# EAGLE design tester (EAGLE 9.6.2)

## Sheet 1 of 5: BUS
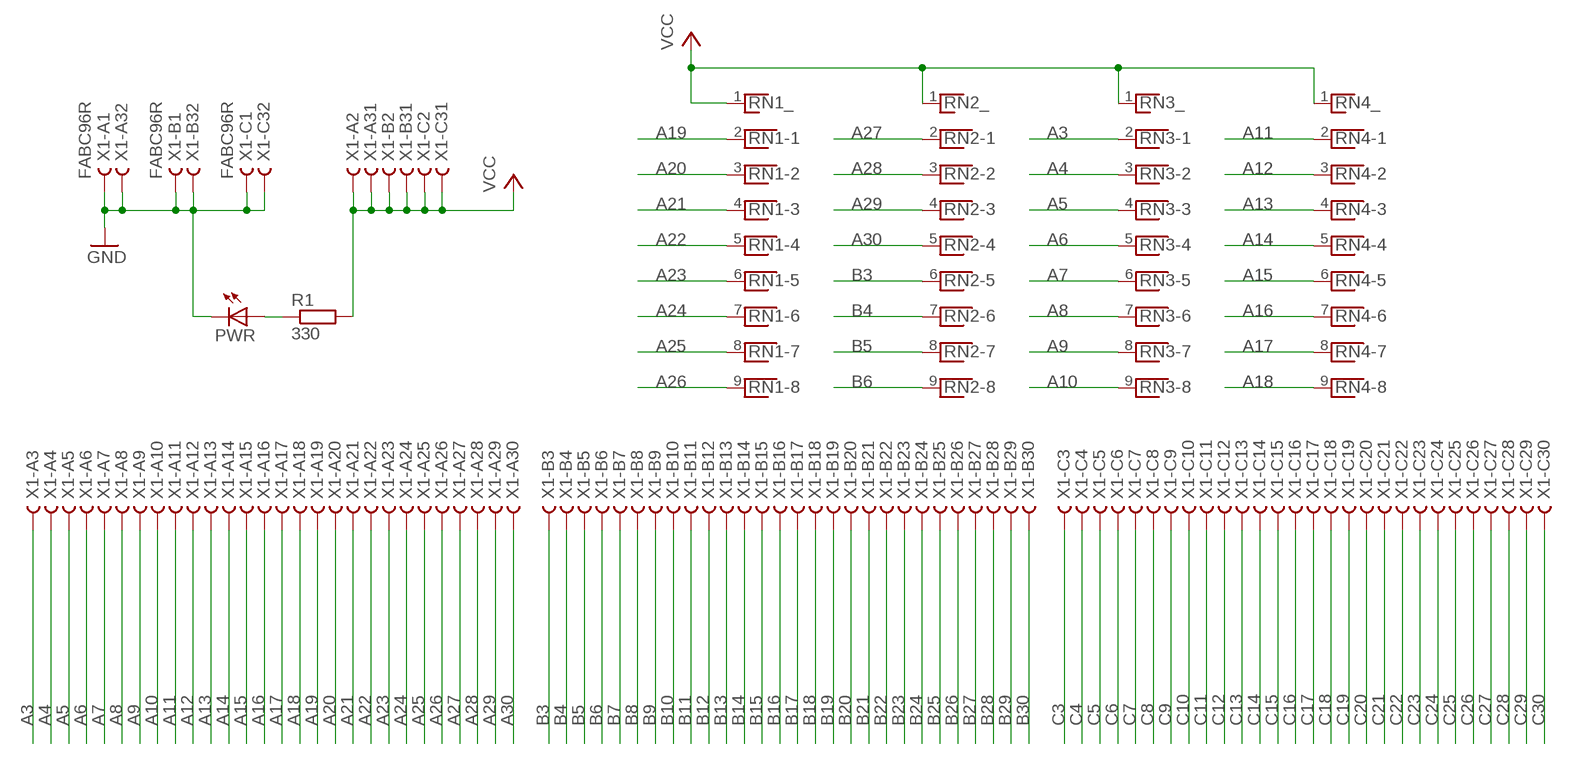
[diagram p0: schematic, sheet 1]

### Parts
PWR  LED5MM  [LED5MM]
R1  330  R0207/10  [0207/10]
RN1  RNX8  [RN-9]
RN2  RNX8  [RN-9]
RN3  RNX8  [RN-9]
RN4  RNX8  [RN-9]
X1  FABC96R  [FABC96R]

### Nets
A3: RN3.2 X1.A3 ; also sheet 5
A4: RN3.3 X1.A4 ; also sheet 5
A5: RN3.4 X1.A5 ; also sheet 5
A6: RN3.5 X1.A6 ; also sheet 5
A7: RN3.6 X1.A7 ; also sheet 5
A8: RN3.7 X1.A8 ; also sheet 5
A9: RN3.8 X1.A9 ; also sheet 5
A10: RN3.9 X1.A10 ; also sheet 5
A11: RN4.2 X1.A11 ; also sheet 5
A12: RN4.3 X1.A12 ; also sheet 5
A13: RN4.4 X1.A13 ; also sheet 5
A14: RN4.5 X1.A14 ; also sheet 5
A15: RN4.6 X1.A15 ; also sheet 5
A16: RN4.7 X1.A16 ; also sheet 5
A17: RN4.8 X1.A17 ; also sheet 5
A18: RN4.9 X1.A18 ; also sheet 5
A19: RN1.2 X1.A19 ; also sheet 5
A20: RN1.3 X1.A20 ; also sheet 5
A21: RN1.4 X1.A21 ; also sheet 5
A22: RN1.5 X1.A22 ; also sheet 5
A23: RN1.6 X1.A23 ; also sheet 5
A24: RN1.7 X1.A24 ; also sheet 5
A25: RN1.8 X1.A25 ; also sheet 5
A26: RN1.9 X1.A26 ; also sheet 5
A27: RN2.2 X1.A27 ; also sheet 5
A28: RN2.3 X1.A28 ; also sheet 5
A29: RN2.4 X1.A29 ; also sheet 5
A30: RN2.5 X1.A30 ; also sheet 5
B3: RN2.6 X1.B3 ; also sheet 5
B4: RN2.7 X1.B4 ; also sheet 5
B5: RN2.8 X1.B5 ; also sheet 5
B6: RN2.9 X1.B6 ; also sheet 5
B7: X1.B7 ; also sheet 5
B8: X1.B8 ; also sheet 5
B9: X1.B9 ; also sheet 5
B10: X1.B10 ; also sheet 5
B11: X1.B11 ; also sheet 5
B12: X1.B12 ; also sheet 5
B13: X1.B13 ; also sheet 5
B14: X1.B14 ; also sheet 5
B15: X1.B15 ; also sheet 5
B16: X1.B16 ; also sheet 5
B17: X1.B17 ; also sheet 5
B18: X1.B18 ; also sheet 5
B19: X1.B19 ; also sheet 5
B20: X1.B20 ; also sheet 5
B21: X1.B21 ; also sheet 5
B22: X1.B22 ; also sheet 5
B23: X1.B23 ; also sheet 5
B24: X1.B24 ; also sheet 5
B25: X1.B25 ; also sheet 5
B26: X1.B26 ; also sheet 5
B27: X1.B27 ; also sheet 5
B28: X1.B28 ; also sheet 5
B29: X1.B29 ; also sheet 5
B30: X1.B30 ; also sheet 5
C3: X1.C3 ; also sheet 5
C4: X1.C4 ; also sheet 5
C5: X1.C5 ; also sheet 5
C6: X1.C6 ; also sheet 5
C7: X1.C7 ; also sheet 5
C8: X1.C8 ; also sheet 5
C9: X1.C9 ; also sheet 5
C10: X1.C10 ; also sheet 5
C11: X1.C11 ; also sheet 5
C12: X1.C12 ; also sheet 5
C13: X1.C13 ; also sheet 5
C14: X1.C14 ; also sheet 5
C15: X1.C15 ; also sheet 5
C16: X1.C16 ; also sheet 5
C17: X1.C17 ; also sheet 5
C18: X1.C18 ; also sheet 5
C19: X1.C19 ; also sheet 5
C20: X1.C20 ; also sheet 5
C21: X1.C21 ; also sheet 5
C22: X1.C22 ; also sheet 5
C23: X1.C23 ; also sheet 5
C24: X1.C24 ; also sheet 5
C25: X1.C25 ; also sheet 5
C26: X1.C26 ; also sheet 5
C27: X1.C27 ; also sheet 5
C28: X1.C28 ; also sheet 5
C29: X1.C29 ; also sheet 5
C30: X1.C30 ; also sheet 5
GND: PWR.K(C) X1.A1 X1.A32 X1.B1 X1.B32 X1.C1 X1.C32 ; also sheet 2,3,4,5
N$5: PWR.A R1.1
VCC: R1.2 RN1.1 RN2.1 RN3.1 RN4.1 X1.A2 X1.A31 X1.B2 X1.B31 X1.C2 X1.C31 ; also sheet 2,3,4

## Sheet 2 of 5: bus cntl
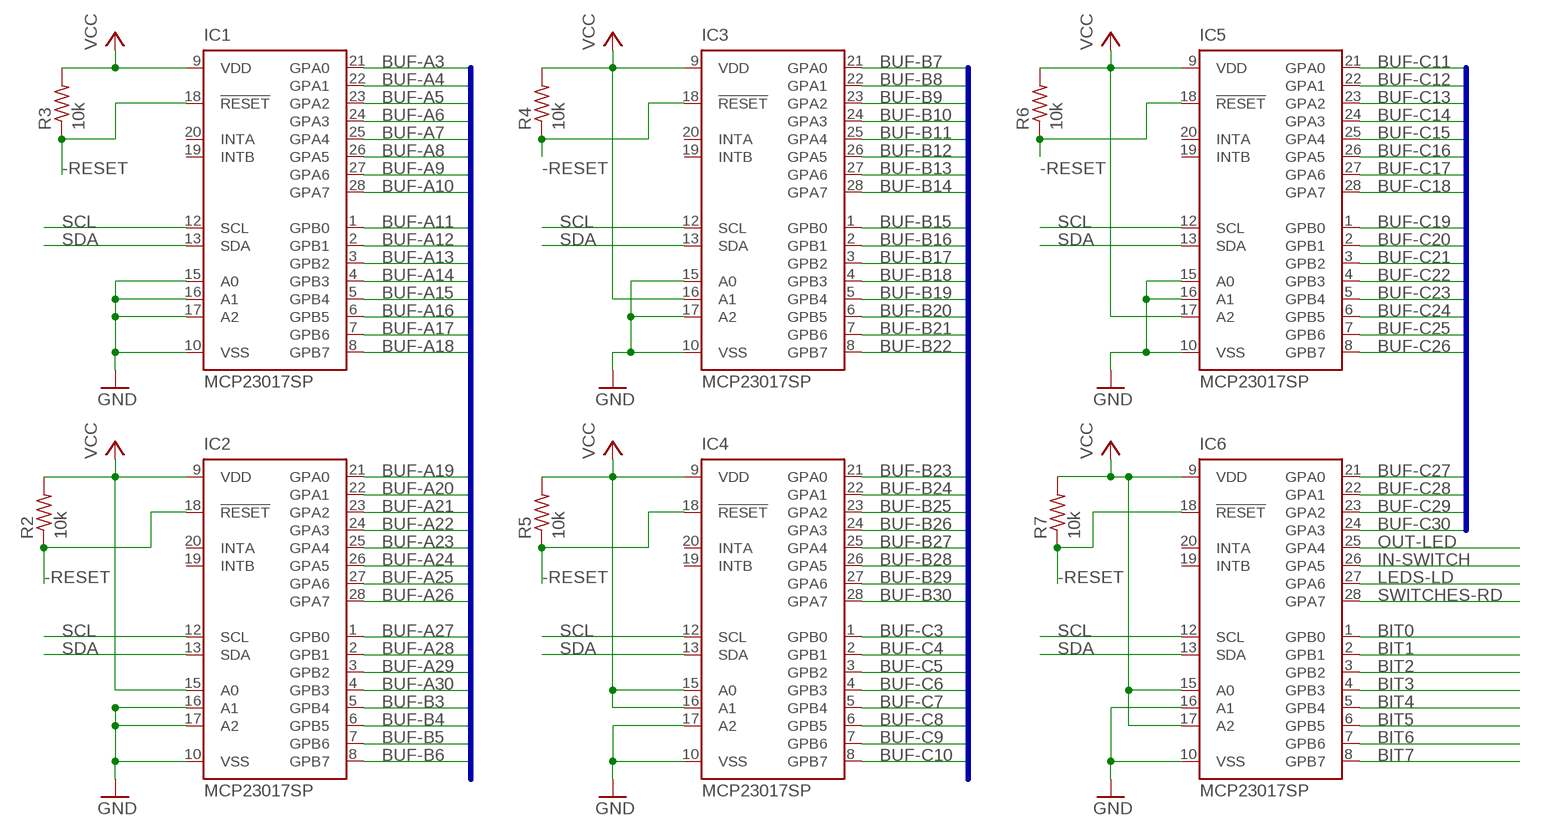
[diagram p1: schematic, sheet 2]

### Parts
IC1  MCP23017SP  [DIL28-3]
IC2  MCP23017SP  [DIL28-3]
IC3  MCP23017SP  [DIL28-3]
IC4  MCP23017SP  [DIL28-3]
IC5  MCP23017SP  [DIL28-3]
IC6  MCP23017SP  [DIL28-3]
R2  10k  R-US_0207/10  [0207/10]
R3  10k  R-US_0207/10  [0207/10]
R4  10k  R-US_0207/10  [0207/10]
R5  10k  R-US_0207/10  [0207/10]
R6  10k  R-US_0207/10  [0207/10]
R7  10k  R-US_0207/10  [0207/10]

### Nets
-RESET: IC1.18(!RESET) IC2.18(!RESET) IC3.18(!RESET) IC4.18(!RESET) IC5.18(!RESET) IC6.18(!RESET) R2.1 R3.1 R4.1 R5.1 R6.1 R7.1 ; also sheet 3
BIT0: IC6.1(GPB0) ; also sheet 4
BIT1: IC6.2(GPB1) ; also sheet 4
BIT2: IC6.3(GPB2) ; also sheet 4
BIT3: IC6.4(GPB3) ; also sheet 4
BIT4: IC6.5(GPB4) ; also sheet 4
BIT5: IC6.6(GPB5) ; also sheet 4
BIT6: IC6.7(GPB6) ; also sheet 4
BIT7: IC6.8(GPB7) ; also sheet 4
BUF-A3: IC1.21(GPA0) ; also sheet 5
BUF-A4: IC1.22(GPA1) ; also sheet 5
BUF-A5: IC1.23(GPA2) ; also sheet 5
BUF-A6: IC1.24(GPA3) ; also sheet 5
BUF-A7: IC1.25(GPA4) ; also sheet 5
BUF-A8: IC1.26(GPA5) ; also sheet 5
BUF-A9: IC1.27(GPA6) ; also sheet 5
BUF-A10: IC1.28(GPA7) ; also sheet 5
BUF-A11: IC1.1(GPB0) ; also sheet 5
BUF-A12: IC1.2(GPB1) ; also sheet 5
BUF-A13: IC1.3(GPB2) ; also sheet 5
BUF-A14: IC1.4(GPB3) ; also sheet 5
BUF-A15: IC1.5(GPB4) ; also sheet 5
BUF-A16: IC1.6(GPB5) ; also sheet 5
BUF-A17: IC1.7(GPB6) ; also sheet 5
BUF-A18: IC1.8(GPB7) ; also sheet 5
BUF-A19: IC2.21(GPA0) ; also sheet 5
BUF-A20: IC2.22(GPA1) ; also sheet 5
BUF-A21: IC2.23(GPA2) ; also sheet 5
BUF-A22: IC2.24(GPA3) ; also sheet 5
BUF-A23: IC2.25(GPA4) ; also sheet 5
BUF-A24: IC2.26(GPA5) ; also sheet 5
BUF-A25: IC2.27(GPA6) ; also sheet 5
BUF-A26: IC2.28(GPA7) ; also sheet 5
BUF-A27: IC2.1(GPB0) ; also sheet 5
BUF-A28: IC2.2(GPB1) ; also sheet 5
BUF-A29: IC2.3(GPB2) ; also sheet 5
BUF-A30: IC2.4(GPB3) ; also sheet 5
BUF-B3: IC2.5(GPB4) ; also sheet 5
BUF-B4: IC2.6(GPB5) ; also sheet 5
BUF-B5: IC2.7(GPB6) ; also sheet 5
BUF-B6: IC2.8(GPB7) ; also sheet 5
BUF-B7: IC3.21(GPA0) ; also sheet 5
BUF-B8: IC3.22(GPA1) ; also sheet 5
BUF-B9: IC3.23(GPA2) ; also sheet 5
BUF-B10: IC3.24(GPA3) ; also sheet 5
BUF-B11: IC3.25(GPA4) ; also sheet 5
BUF-B12: IC3.26(GPA5) ; also sheet 5
BUF-B13: IC3.27(GPA6) ; also sheet 5
BUF-B14: IC3.28(GPA7) ; also sheet 5
BUF-B15: IC3.1(GPB0) ; also sheet 5
BUF-B16: IC3.2(GPB1) ; also sheet 5
BUF-B17: IC3.3(GPB2) ; also sheet 5
BUF-B18: IC3.4(GPB3) ; also sheet 5
BUF-B19: IC3.5(GPB4) ; also sheet 5
BUF-B20: IC3.6(GPB5) ; also sheet 5
BUF-B21: IC3.7(GPB6) ; also sheet 5
BUF-B22: IC3.8(GPB7) ; also sheet 5
BUF-B23: IC4.21(GPA0) ; also sheet 5
BUF-B24: IC4.22(GPA1) ; also sheet 5
BUF-B25: IC4.23(GPA2) ; also sheet 5
BUF-B26: IC4.24(GPA3) ; also sheet 5
BUF-B27: IC4.25(GPA4) ; also sheet 5
BUF-B28: IC4.26(GPA5) ; also sheet 5
BUF-B29: IC4.27(GPA6) ; also sheet 5
BUF-B30: IC4.28(GPA7) ; also sheet 5
BUF-C3: IC4.1(GPB0) ; also sheet 5
BUF-C4: IC4.2(GPB1) ; also sheet 5
BUF-C5: IC4.3(GPB2) ; also sheet 5
BUF-C6: IC4.4(GPB3) ; also sheet 5
BUF-C7: IC4.5(GPB4) ; also sheet 5
BUF-C8: IC4.6(GPB5) ; also sheet 5
BUF-C9: IC4.7(GPB6) ; also sheet 5
BUF-C10: IC4.8(GPB7) ; also sheet 5
BUF-C11: IC5.21(GPA0) ; also sheet 5
BUF-C12: IC5.22(GPA1) ; also sheet 5
BUF-C13: IC5.23(GPA2) ; also sheet 5
BUF-C14: IC5.24(GPA3) ; also sheet 5
BUF-C15: IC5.25(GPA4) ; also sheet 5
BUF-C16: IC5.26(GPA5) ; also sheet 5
BUF-C17: IC5.27(GPA6) ; also sheet 5
BUF-C18: IC5.28(GPA7) ; also sheet 5
BUF-C19: IC5.1(GPB0) ; also sheet 5
BUF-C20: IC5.2(GPB1) ; also sheet 5
BUF-C21: IC5.3(GPB2) ; also sheet 5
BUF-C22: IC5.4(GPB3) ; also sheet 5
BUF-C23: IC5.5(GPB4) ; also sheet 5
BUF-C24: IC5.6(GPB5) ; also sheet 5
BUF-C25: IC5.7(GPB6) ; also sheet 5
BUF-C26: IC5.8(GPB7) ; also sheet 5
BUF-C27: IC6.21(GPA0) ; also sheet 5
BUF-C28: IC6.22(GPA1) ; also sheet 5
BUF-C29: IC6.23(GPA2) ; also sheet 5
BUF-C30: IC6.24(GPA3) ; also sheet 5
GND: IC1.10(VSS) IC1.15(A0) IC1.16(A1) IC1.17(A2) IC2.10(VSS) IC2.16(A1) IC2.17(A2) IC3.10(VSS) IC3.15(A0) IC3.17(A2) IC4.10(VSS) IC4.17(A2) IC5.10(VSS) IC5.15(A0) IC5.16(A1) IC6.10(VSS) IC6.16(A1) ; also sheet 1,3,4,5
IN-SWITCH: IC6.26(GPA5) ; also sheet 4
LEDS-LD: IC6.27(GPA6) ; also sheet 4
OUT-LED: IC6.25(GPA4) ; also sheet 4
SCL: IC1.12(SCL) IC2.12(SCL) IC3.12(SCL) IC4.12(SCL) IC5.12(SCL) IC6.12(SCL) ; also sheet 3
SDA: IC1.13(SDA) IC2.13(SDA) IC3.13(SDA) IC4.13(SDA) IC5.13(SDA) IC6.13(SDA) ; also sheet 3
SWITCHES-RD: IC6.28(GPA7) ; also sheet 4
VCC: IC1.9(VDD) IC2.9(VDD) IC2.15(A0) IC3.9(VDD) IC3.16(A1) IC4.9(VDD) IC4.15(A0) IC4.16(A1) IC5.9(VDD) IC5.17(A2) IC6.9(VDD) IC6.15(A0) IC6.17(A2) R2.2 R3.2 R4.2 R5.2 R6.2 R7.2 ; also sheet 1,3,4
Unconnected: IC1.19(INTB) IC1.20(INTA) IC2.19(INTB) IC2.20(INTA) IC3.19(INTB) IC3.20(INTA) IC4.19(INTB) IC4.20(INTA) IC5.19(INTB) IC5.20(INTA) IC6.19(INTB) IC6.20(INTA)

### Buses
BUF-A3,BUF-A4,BUF-A5,BUF-A6,BUF-A7,BUF-A8,BUF-A9,BUF-A10,BUF-A11,BUF-A12,BUF-A13,BUF-A14,BUF-A15,BUF-A16,BUF-A17,BUF-A18,BUF-A19,BUF-A20,BUF-A21,BUF-A22,BUF-A23,BUF-A24,BUF-A25,BUF-A26,BUF-A27,BUF-A28,BUF-A29,BUF-A30,BUF-B3,BUF-B4,BUF-B5,BUF-B6,BUF-B7,BUF-B8,BUF-B9,BUF-B10,BUF-B11,BUF-B12,BUF-B13,BUF-B14,BUF-B15,BUF-B16,BUF-B17,BUF-B18,BUF-B19,BUF-B20,BUF-B21,BUF-B22,BUF-B23,BUF-B24,BUF-B25,BUF-B26,BUF-B27,BUF-B28,BUF-B29,BUF-B30,BUF-C3,BUF-C4,BUF-C5,BUF-C6,BUF-C7,BUF-C8,BUF-C9,BUF-C10,BUF-C11,BUF-C12,BUF-C13,BUF-C14,BUF-C15,BUF-C16,BUF-C17,BUF-C18,BUF-C19,BUF-C20,BUF-C21,BUF-C22,BUF-C23,BUF-C24,BUF-C25,BUF-C26,BUF-C27,BUF-C28,BUF-C29,BUF-C30

## Sheet 3 of 5: CPU
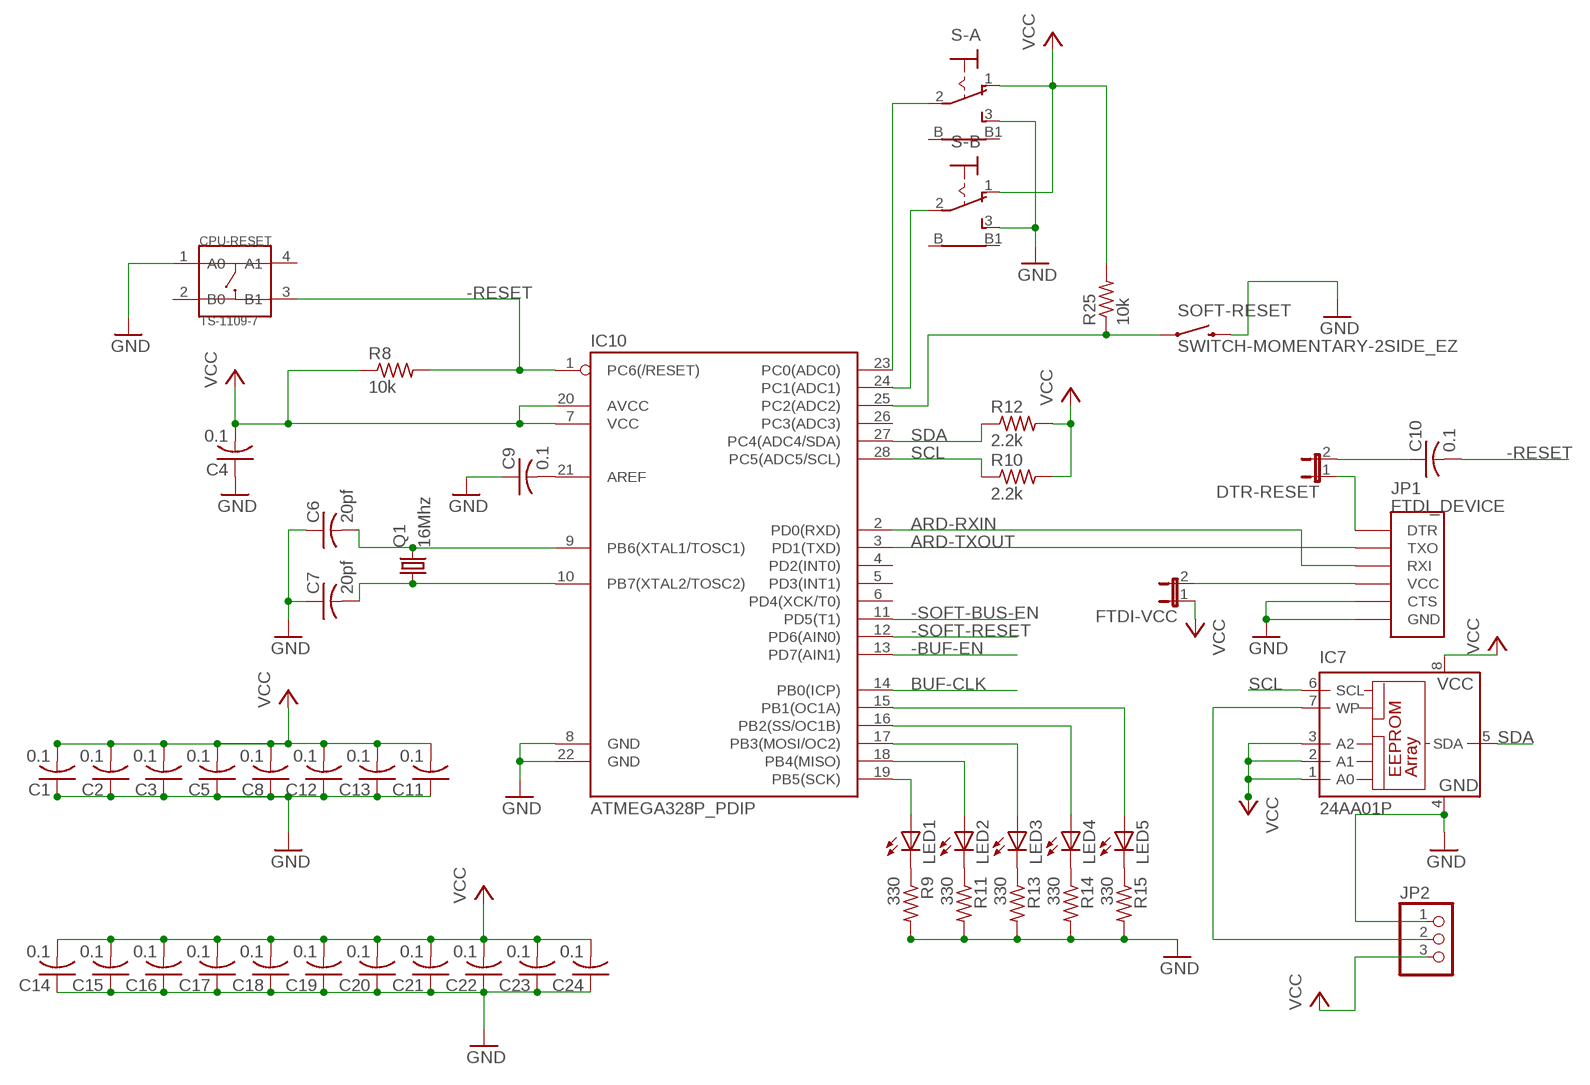
[diagram p2: schematic, sheet 3]

### Parts
C1  0.1  C-US025-024X044  [C025-024X044]
C2  0.1  C-US025-024X044  [C025-024X044]
C3  0.1  C-US025-024X044  [C025-024X044]
C4  0.1  C-US025-024X044  [C025-024X044]
C5  0.1  C-US025-024X044  [C025-024X044]
C6  20pf  C-US025-024X044  [C025-024X044]
C7  20pf  C-US025-024X044  [C025-024X044]
C8  0.1  C-US025-024X044  [C025-024X044]
C9  0.1  C-US025-024X044  [C025-024X044]
C10  0.1  C-US025-024X044  [C025-024X044]
C11  0.1  C-US025-024X044  [C025-024X044]
C12  0.1  C-US025-024X044  [C025-024X044]
C13  0.1  C-US025-024X044  [C025-024X044]
C14  0.1  C-US025-024X044  [C025-024X044]
C15  0.1  C-US025-024X044  [C025-024X044]
C16  0.1  C-US025-024X044  [C025-024X044]
C17  0.1  C-US025-024X044  [C025-024X044]
C18  0.1  C-US025-024X044  [C025-024X044]
C19  0.1  C-US025-024X044  [C025-024X044]
C20  0.1  C-US025-024X044  [C025-024X044]
C21  0.1  C-US025-024X044  [C025-024X044]
C22  0.1  C-US025-024X044  [C025-024X044]
C23  0.1  C-US025-024X044  [C025-024X044]
C24  0.1  C-US025-024X044  [C025-024X044]
CPU-RESET  TS-1109-7  DIP-BUTTON-TOP-BLACK(4P-D6.2MM)  [SW4-6.2X6.2X5.0MM]
DTR-RESET  JP1E  [JP1]
FTDI-VCC  JP1E  [JP1]
IC7  24AA01P  [DIL8]
IC10  ATMEGA328P_PDIP  [DIL28-3]
JP1  FTDI_DEVICE  [FTDI_DEVICE_SIDE]
JP2  PINHD-1X3  [1X03]
LED1  LED5MM  [LED5MM]
LED2  LED5MM  [LED5MM]
LED3  LED5MM  [LED5MM]
LED4  LED5MM  [LED5MM]
LED5  LED5MM  [LED5MM]
Q1  16Mhz  CRYSTALHC49S  [HC49/S]
R8  10k  R-US_0207/10  [0207/10]
R9  330  R-US_0207/10  [0207/10]
R10  2.2k  R-US_0207/10  [0207/10]
R11  330  R-US_0207/10  [0207/10]
R12  2.2k  R-US_0207/10  [0207/10]
R13  330  R-US_0207/10  [0207/10]
R14  330  R-US_0207/10  [0207/10]
R15  330  R-US_0207/10  [0207/10]
R25  10k  R-US_0207/10  [0207/10]
S-A  9070-1W  [9070-1W]
S-B  9070-1W  [9070-1W]
SOFT-RESET  SWITCH-MOMENTARY-2SIDE_EZ  [TACTILE-PTH-SIDEEZ]

### Nets
-BUF-EN: IC10.13(PD7(AIN1)) ; also sheet 5
-RESET: C10.2 CPU-RESET.3(B1) IC10.1(PC6(/RESET)) R8.2 ; also sheet 2
-SOFT-BUS-EN: IC10.11(PD5(T1)) ; also sheet 5
-SOFT-RESET: IC10.12(PD6(AIN0)) ; also sheet 5
ARD-RXIN: IC10.2(PD0(RXD)) JP1.P$3(RXI)
ARD-TXOUT: IC10.3(PD1(TXD)) JP1.P$2(TXO)
BUF-CLK: IC10.14(PB0(ICP)) ; also sheet 5
GND: C1.1 C2.1 C3.1 C4.1 C5.1 C6.1 C7.1 C8.1 C9.1 C11.1 C12.1 C13.1 C14.1 C15.1 C16.1 C17.1 C18.1 C19.1 C20.1 C21.1 C22.1 C23.1 C24.1 CPU-RESET.1(A0) IC7.4(GND) IC10.8(GND) IC10.22(GND) JP1.P$5(CTS) JP1.P$6(GND) JP2.1 R9.2 R11.2 R13.2 R14.2 R15.2 S-A.3(S) S-B.3(S) SOFT-RESET.2 ; also sheet 1,2,4,5
N$1: IC10.19(PB5(SCK)) LED1.A
N$2: IC7.7(WP) JP2.2
N$3: C6.2 IC10.9(PB6(XTAL1/TOSC1)) Q1.2
N$4: C7.2 IC10.10(PB7(XTAL2/TOSC2)) Q1.1
N$6: IC10.18(PB4(MISO)) LED2.A
N$7: IC10.17(PB3(MOSI/OC2)) LED3.A
N$8: IC10.16(PB2(SS/OC1B)) LED4.A
N$9: C10.1 DTR-RESET.2
N$10: IC10.15(PB1(OC1A)) LED5.A
N$11: LED2.K(C) R11.1
N$12: LED1.K(C) R9.1
N$13: LED3.K(C) R13.1
N$14: C9.2 IC10.21(AREF)
N$15: LED4.K(C) R14.1
N$16: LED5.K(C) R15.1
N$18: IC10.23(PC0(ADC0)) S-A.2(P)
N$19: IC10.24(PC1(ADC1)) S-B.2(P)
N$28: DTR-RESET.1 JP1.P$1(DTR)
N$29: FTDI-VCC.2 JP1.P$4(VCC)
N$39: IC10.25(PC2(ADC2)) R25.1 SOFT-RESET.1
SCL: IC7.6(SCL) IC10.28(PC5(ADC5/SCL)) R10.1 ; also sheet 2
SDA: IC7.5(SDA) IC10.27(PC4(ADC4/SDA)) R12.1 ; also sheet 2
VCC: C1.2 C2.2 C3.2 C4.2 C5.2 C8.2 C11.2 C12.2 C13.2 C14.2 C15.2 C16.2 C17.2 C18.2 C19.2 C20.2 C21.2 C22.2 C23.2 C24.2 FTDI-VCC.1 IC7.1(A0) IC7.2(A1) IC7.3(A2) IC7.8(VCC) IC10.7(VCC) IC10.20(AVCC) JP2.3 R8.1 R10.2 R12.2 R25.2 S-A.1(O) S-B.1(O) ; also sheet 1,2,4
Unconnected: CPU-RESET.2(B0) CPU-RESET.4(A1) IC10.4(PD2(INT0)) IC10.5(PD3(INT1)) IC10.6(PD4(XCK/T0)) IC10.26(PC3(ADC3)) S-A.B S-A.B1 S-B.B S-B.B1

## Sheet 4 of 5: I/O
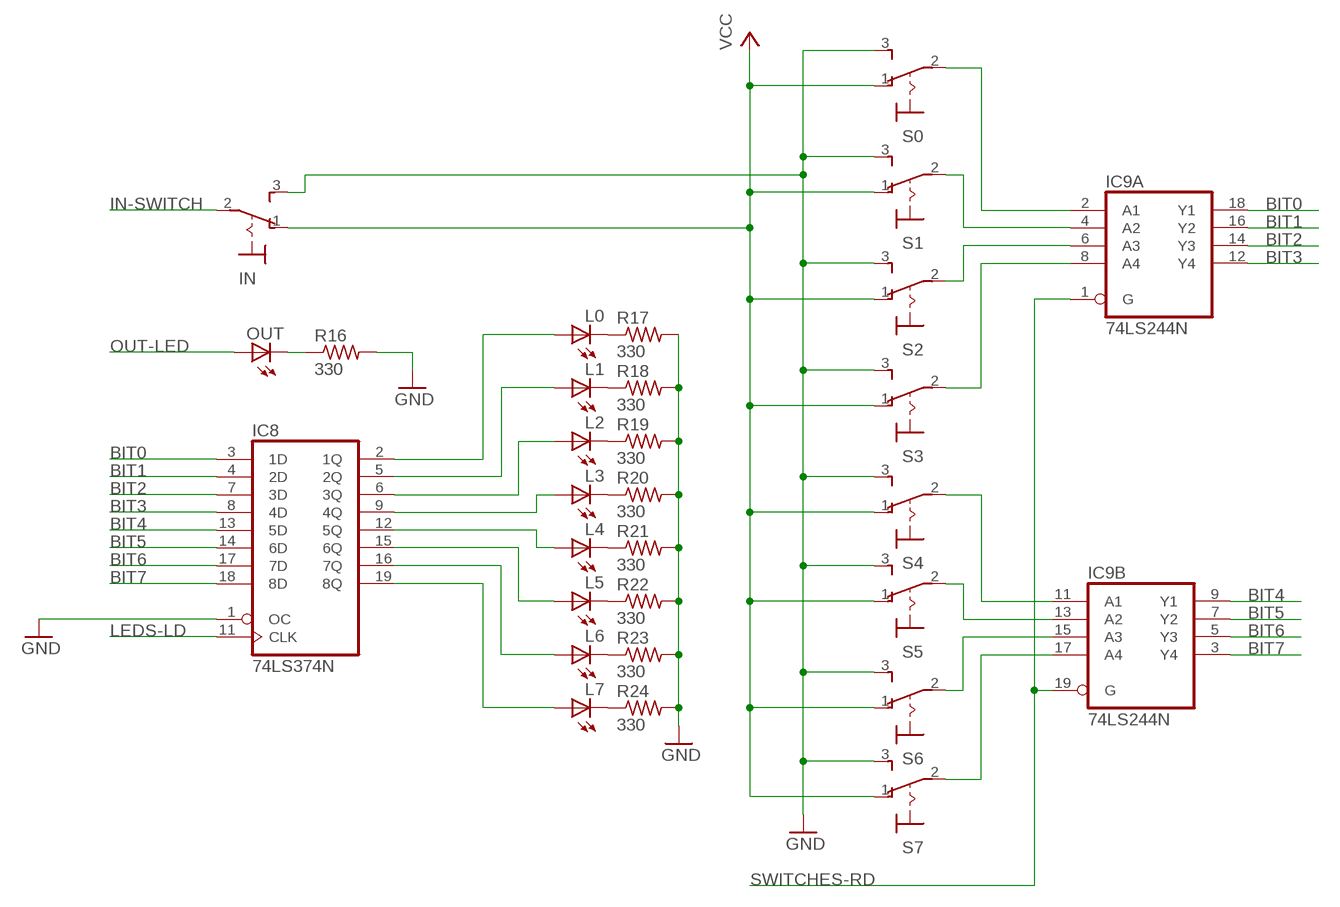
[diagram p3: schematic, sheet 4]

### Parts
IC8  74LS374N  [DIL20]
IC9  74LS244N  [DIL20]
IN  M9040P  [M9040P]
L0  LED5MM  [LED5MM]
L1  LED5MM  [LED5MM]
L2  LED5MM  [LED5MM]
L3  LED5MM  [LED5MM]
L4  LED5MM  [LED5MM]
L5  LED5MM  [LED5MM]
L6  LED5MM  [LED5MM]
L7  LED5MM  [LED5MM]
OUT  LED5MM  [LED5MM]
R16  330  R-US_0207/10  [0207/10]
R17  330  R-US_0207/10  [0207/10]
R18  330  R-US_0207/10  [0207/10]
R19  330  R-US_0207/10  [0207/10]
R20  330  R-US_0207/10  [0207/10]
R21  330  R-US_0207/10  [0207/10]
R22  330  R-US_0207/10  [0207/10]
R23  330  R-US_0207/10  [0207/10]
R24  330  R-US_0207/10  [0207/10]
S0  M9040P  [M9040P]
S1  M9040P  [M9040P]
S2  M9040P  [M9040P]
S3  M9040P  [M9040P]
S4  M9040P  [M9040P]
S5  M9040P  [M9040P]
S6  M9040P  [M9040P]
S7  M9040P  [M9040P]

### Nets
BIT0: IC8.3(1D) IC9.18(A:Y1) ; also sheet 2
BIT1: IC8.4(2D) IC9.16(A:Y2) ; also sheet 2
BIT2: IC8.7(3D) IC9.14(A:Y3) ; also sheet 2
BIT3: IC8.8(4D) IC9.12(A:Y4) ; also sheet 2
BIT4: IC8.13(5D) IC9.9(B:Y1) ; also sheet 2
BIT5: IC8.14(6D) IC9.7(B:Y2) ; also sheet 2
BIT6: IC8.17(7D) IC9.5(B:Y3) ; also sheet 2
BIT7: IC8.18(8D) IC9.3(B:Y4) ; also sheet 2
GND: IC8.1(OC) IN.3(S) R16.2 R17.2 R18.2 R19.2 R20.2 R21.2 R22.2 R23.2 R24.2 S0.3(S) S1.3(S) S2.3(S) S3.3(S) S4.3(S) S5.3(S) S6.3(S) S7.3(S) ; also sheet 1,2,3,5
IN-SWITCH: IN.2(P) ; also sheet 2
LEDS-LD: IC8.11(CLK) ; also sheet 2
N$17: L7.K(C) R24.1
N$20: L6.K(C) R23.1
N$21: L5.K(C) R22.1
N$22: L4.K(C) R21.1
N$23: L3.K(C) R20.1
N$24: L2.K(C) R19.1
N$25: L1.K(C) R18.1
N$26: L0.K(C) R17.1
N$27: OUT.K(C) R16.1
N$31: IC8.5(2Q) L1.A
N$32: IC8.9(4Q) L3.A
N$33: IC8.12(5Q) L4.A
N$34: IC8.15(6Q) L5.A
N$35: IC8.6(3Q) L2.A
N$36: IC8.16(7Q) L6.A
N$37: IC8.19(8Q) L7.A
N$38: IC8.2(1Q) L0.A
N$40: IC9.2(A:A1) S0.2(P)
N$41: IC9.8(A:A4) S3.2(P)
N$42: IC9.6(A:A3) S2.2(P)
N$43: IC9.4(A:A2) S1.2(P)
N$44: IC9.11(B:A1) S4.2(P)
N$45: IC9.17(B:A4) S7.2(P)
N$46: IC9.13(B:A2) S5.2(P)
N$47: IC9.15(B:A3) S6.2(P)
OUT-LED: OUT.A ; also sheet 2
SWITCHES-RD: IC9.1(A:G) IC9.19(B:G) ; also sheet 2
VCC: IN.1(O) S0.1(O) S1.1(O) S2.1(O) S3.1(O) S4.1(O) S5.1(O) S6.1(O) S7.1(O) ; also sheet 1,2,3

## Sheet 5 of 5: Bus Latches
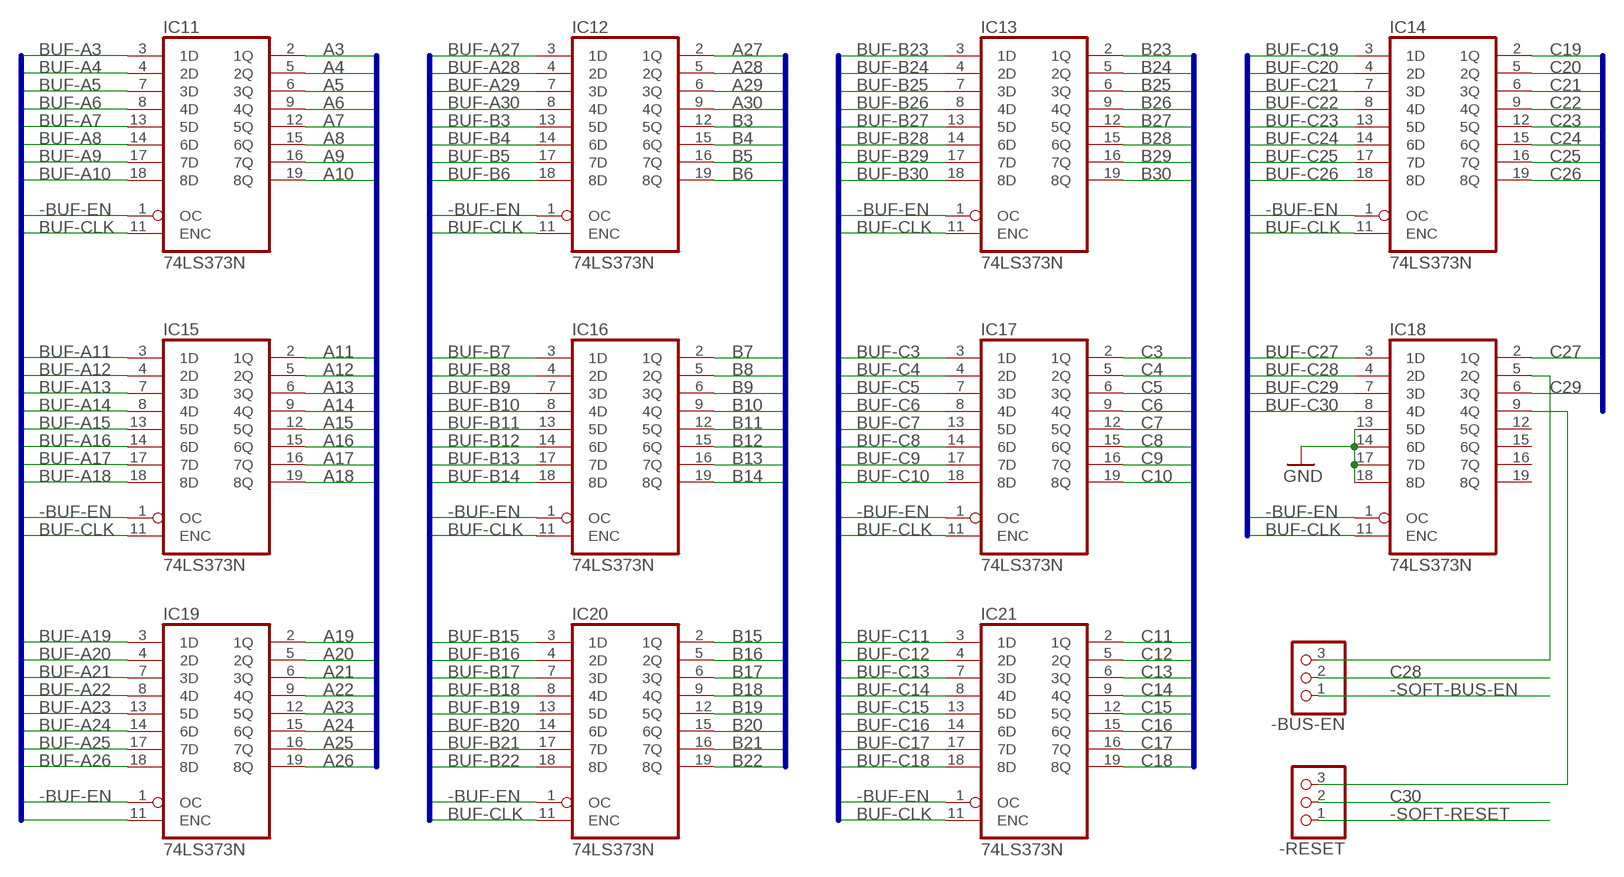
[diagram p4: schematic, sheet 5]

### Parts
-BUS-EN  PINHD-1X3  [1X03]
-RESET  PINHD-1X3  [1X03]
IC11  74LS373N  [DIL20]
IC12  74LS373N  [DIL20]
IC13  74LS373N  [DIL20]
IC14  74LS373N  [DIL20]
IC15  74LS373N  [DIL20]
IC16  74LS373N  [DIL20]
IC17  74LS373N  [DIL20]
IC18  74LS373N  [DIL20]
IC19  74LS373N  [DIL20]
IC20  74LS373N  [DIL20]
IC21  74LS373N  [DIL20]

### Nets
-BUF-EN: IC11.1(OC) IC12.1(OC) IC13.1(OC) IC14.1(OC) IC15.1(OC) IC16.1(OC) IC17.1(OC) IC18.1(OC) IC19.1(OC) IC20.1(OC) IC21.1(OC) ; also sheet 3
-SOFT-BUS-EN: -BUS-EN.1 ; also sheet 3
-SOFT-RESET: -RESET.1 ; also sheet 3
A3: IC11.2(1Q) ; also sheet 1
A4: IC11.5(2Q) ; also sheet 1
A5: IC11.6(3Q) ; also sheet 1
A6: IC11.9(4Q) ; also sheet 1
A7: IC11.12(5Q) ; also sheet 1
A8: IC11.15(6Q) ; also sheet 1
A9: IC11.16(7Q) ; also sheet 1
A10: IC11.19(8Q) ; also sheet 1
A11: IC15.2(1Q) ; also sheet 1
A12: IC15.5(2Q) ; also sheet 1
A13: IC15.6(3Q) ; also sheet 1
A14: IC15.9(4Q) ; also sheet 1
A15: IC15.12(5Q) ; also sheet 1
A16: IC15.15(6Q) ; also sheet 1
A17: IC15.16(7Q) ; also sheet 1
A18: IC15.19(8Q) ; also sheet 1
A19: IC19.2(1Q) ; also sheet 1
A20: IC19.5(2Q) ; also sheet 1
A21: IC19.6(3Q) ; also sheet 1
A22: IC19.9(4Q) ; also sheet 1
A23: IC19.12(5Q) ; also sheet 1
A24: IC19.15(6Q) ; also sheet 1
A25: IC19.16(7Q) ; also sheet 1
A26: IC19.19(8Q) ; also sheet 1
A27: IC12.2(1Q) ; also sheet 1
A28: IC12.5(2Q) ; also sheet 1
A29: IC12.6(3Q) ; also sheet 1
A30: IC12.9(4Q) ; also sheet 1
B3: IC12.12(5Q) ; also sheet 1
B4: IC12.15(6Q) ; also sheet 1
B5: IC12.16(7Q) ; also sheet 1
B6: IC12.19(8Q) ; also sheet 1
B7: IC16.2(1Q) ; also sheet 1
B8: IC16.5(2Q) ; also sheet 1
B9: IC16.6(3Q) ; also sheet 1
B10: IC16.9(4Q) ; also sheet 1
B11: IC16.12(5Q) ; also sheet 1
B12: IC16.15(6Q) ; also sheet 1
B13: IC16.16(7Q) ; also sheet 1
B14: IC16.19(8Q) ; also sheet 1
B15: IC20.2(1Q) ; also sheet 1
B16: IC20.5(2Q) ; also sheet 1
B17: IC20.6(3Q) ; also sheet 1
B18: IC20.9(4Q) ; also sheet 1
B19: IC20.12(5Q) ; also sheet 1
B20: IC20.15(6Q) ; also sheet 1
B21: IC20.16(7Q) ; also sheet 1
B22: IC20.19(8Q) ; also sheet 1
B23: IC13.2(1Q) ; also sheet 1
B24: IC13.5(2Q) ; also sheet 1
B25: IC13.6(3Q) ; also sheet 1
B26: IC13.9(4Q) ; also sheet 1
B27: IC13.12(5Q) ; also sheet 1
B28: IC13.15(6Q) ; also sheet 1
B29: IC13.16(7Q) ; also sheet 1
B30: IC13.19(8Q) ; also sheet 1
BUF-A3: IC11.3(1D) ; also sheet 2
BUF-A4: IC11.4(2D) ; also sheet 2
BUF-A5: IC11.7(3D) ; also sheet 2
BUF-A6: IC11.8(4D) ; also sheet 2
BUF-A7: IC11.13(5D) ; also sheet 2
BUF-A8: IC11.14(6D) ; also sheet 2
BUF-A9: IC11.17(7D) ; also sheet 2
BUF-A10: IC11.18(8D) ; also sheet 2
BUF-A11: IC15.3(1D) ; also sheet 2
BUF-A12: IC15.4(2D) ; also sheet 2
BUF-A13: IC15.7(3D) ; also sheet 2
BUF-A14: IC15.8(4D) ; also sheet 2
BUF-A15: IC15.13(5D) ; also sheet 2
BUF-A16: IC15.14(6D) ; also sheet 2
BUF-A17: IC15.17(7D) ; also sheet 2
BUF-A18: IC15.18(8D) ; also sheet 2
BUF-A19: IC19.3(1D) ; also sheet 2
BUF-A20: IC19.4(2D) ; also sheet 2
BUF-A21: IC19.7(3D) ; also sheet 2
BUF-A22: IC19.8(4D) ; also sheet 2
BUF-A23: IC19.13(5D) ; also sheet 2
BUF-A24: IC19.14(6D) ; also sheet 2
BUF-A25: IC19.17(7D) ; also sheet 2
BUF-A26: IC19.18(8D) ; also sheet 2
BUF-A27: IC12.3(1D) ; also sheet 2
BUF-A28: IC12.4(2D) ; also sheet 2
BUF-A29: IC12.7(3D) ; also sheet 2
BUF-A30: IC12.8(4D) ; also sheet 2
BUF-B3: IC12.13(5D) ; also sheet 2
BUF-B4: IC12.14(6D) ; also sheet 2
BUF-B5: IC12.17(7D) ; also sheet 2
BUF-B6: IC12.18(8D) ; also sheet 2
BUF-B7: IC16.3(1D) ; also sheet 2
BUF-B8: IC16.4(2D) ; also sheet 2
BUF-B9: IC16.7(3D) ; also sheet 2
BUF-B10: IC16.8(4D) ; also sheet 2
BUF-B11: IC16.13(5D) ; also sheet 2
BUF-B12: IC16.14(6D) ; also sheet 2
BUF-B13: IC16.17(7D) ; also sheet 2
BUF-B14: IC16.18(8D) ; also sheet 2
BUF-B15: IC20.3(1D) ; also sheet 2
BUF-B16: IC20.4(2D) ; also sheet 2
BUF-B17: IC20.7(3D) ; also sheet 2
BUF-B18: IC20.8(4D) ; also sheet 2
BUF-B19: IC20.13(5D) ; also sheet 2
BUF-B20: IC20.14(6D) ; also sheet 2
BUF-B21: IC20.17(7D) ; also sheet 2
BUF-B22: IC20.18(8D) ; also sheet 2
BUF-B23: IC13.3(1D) ; also sheet 2
BUF-B24: IC13.4(2D) ; also sheet 2
BUF-B25: IC13.7(3D) ; also sheet 2
BUF-B26: IC13.8(4D) ; also sheet 2
BUF-B27: IC13.13(5D) ; also sheet 2
BUF-B28: IC13.14(6D) ; also sheet 2
BUF-B29: IC13.17(7D) ; also sheet 2
BUF-B30: IC13.18(8D) ; also sheet 2
BUF-C3: IC17.3(1D) ; also sheet 2
BUF-C4: IC17.4(2D) ; also sheet 2
BUF-C5: IC17.7(3D) ; also sheet 2
BUF-C6: IC17.8(4D) ; also sheet 2
BUF-C7: IC17.13(5D) ; also sheet 2
BUF-C8: IC17.14(6D) ; also sheet 2
BUF-C9: IC17.17(7D) ; also sheet 2
BUF-C10: IC17.18(8D) ; also sheet 2
BUF-C11: IC21.3(1D) ; also sheet 2
BUF-C12: IC21.4(2D) ; also sheet 2
BUF-C13: IC21.7(3D) ; also sheet 2
BUF-C14: IC21.8(4D) ; also sheet 2
BUF-C15: IC21.13(5D) ; also sheet 2
BUF-C16: IC21.14(6D) ; also sheet 2
BUF-C17: IC21.17(7D) ; also sheet 2
BUF-C18: IC21.18(8D) ; also sheet 2
BUF-C19: IC14.3(1D) ; also sheet 2
BUF-C20: IC14.4(2D) ; also sheet 2
BUF-C21: IC14.7(3D) ; also sheet 2
BUF-C22: IC14.8(4D) ; also sheet 2
BUF-C23: IC14.13(5D) ; also sheet 2
BUF-C24: IC14.14(6D) ; also sheet 2
BUF-C25: IC14.17(7D) ; also sheet 2
BUF-C26: IC14.18(8D) ; also sheet 2
BUF-C27: IC18.3(1D) ; also sheet 2
BUF-C28: IC18.4(2D) ; also sheet 2
BUF-C29: IC18.7(3D) ; also sheet 2
BUF-C30: IC18.8(4D) ; also sheet 2
BUF-CLK: IC11.11(ENC) IC12.11(ENC) IC13.11(ENC) IC14.11(ENC) IC15.11(ENC) IC16.11(ENC) IC17.11(ENC) IC18.11(ENC) IC19.11(ENC) IC20.11(ENC) IC21.11(ENC) ; also sheet 3
C3: IC17.2(1Q) ; also sheet 1
C4: IC17.5(2Q) ; also sheet 1
C5: IC17.6(3Q) ; also sheet 1
C6: IC17.9(4Q) ; also sheet 1
C7: IC17.12(5Q) ; also sheet 1
C8: IC17.15(6Q) ; also sheet 1
C9: IC17.16(7Q) ; also sheet 1
C10: IC17.19(8Q) ; also sheet 1
C11: IC21.2(1Q) ; also sheet 1
C12: IC21.5(2Q) ; also sheet 1
C13: IC21.6(3Q) ; also sheet 1
C14: IC21.9(4Q) ; also sheet 1
C15: IC21.12(5Q) ; also sheet 1
C16: IC21.15(6Q) ; also sheet 1
C17: IC21.16(7Q) ; also sheet 1
C18: IC21.19(8Q) ; also sheet 1
C19: IC14.2(1Q) ; also sheet 1
C20: IC14.5(2Q) ; also sheet 1
C21: IC14.6(3Q) ; also sheet 1
C22: IC14.9(4Q) ; also sheet 1
C23: IC14.12(5Q) ; also sheet 1
C24: IC14.15(6Q) ; also sheet 1
C25: IC14.16(7Q) ; also sheet 1
C26: IC14.19(8Q) ; also sheet 1
C27: IC18.2(1Q) ; also sheet 1
C28: -BUS-EN.2 ; also sheet 1
C29: IC18.6(3Q) ; also sheet 1
C30: -RESET.2 ; also sheet 1
GND: IC18.13(5D) IC18.14(6D) IC18.17(7D) IC18.18(8D) ; also sheet 1,2,3,4
N$30: -BUS-EN.3 IC18.5(2Q)
N$48: -RESET.3 IC18.9(4Q)
Unconnected: IC18.12(5Q) IC18.15(6Q) IC18.16(7Q) IC18.19(8Q)

### Buses
BUS:A[3..30],B[3..30],C[3..30]
BUF-BUS:BUF-A[3..30],BUF-B[3..30],BUF-C[3..30],BUF-CLK,-BUF-EN

## Power pins joined to a net without a drawn wire
GND: IC8.10(GND) IC9.10(P:GND) IC11.10(GND) IC12.10(GND) IC13.10(GND) IC14.10(GND) IC15.10(GND) IC16.10(GND) IC17.10(GND) IC18.10(GND) IC19.10(GND) IC20.10(GND) IC21.10(GND)
VCC: IC8.20(VCC) IC9.20(P:VCC) IC11.20(VCC) IC12.20(VCC) IC13.20(VCC) IC14.20(VCC) IC15.20(VCC) IC16.20(VCC) IC17.20(VCC) IC18.20(VCC) IC19.20(VCC) IC20.20(VCC) IC21.20(VCC)

## Library data of the parts
-BUS-EN -RESET JP2 = pinhead:PINHD-1X3: PIN HEADER
C1-C24 = adafruit:C-US: CAPACITOR, American symbol
CPU-RESET = Seeed-OPL-Switch:DIP-BUTTON-TOP-BLACK(4P-D6.2MM): 311020032; MPN: TS-1109-7
DTR-RESET FTDI-VCC = jumper:JP1E: JUMPER
IC1-IC6 = microchip:MCP23017: http://ww1.microchip.com/downloads/en/DeviceDoc/21952a.pdf Source: http://ww1.microchip.com/downloads/en/DeviceDoc/21952a.pdf; MF: MICROCHIP; MPN: MCP23017-E/SP; OC_FARNELL: 1332088; OC_NEWARK: 31K2959
IC7 = microchip:24*: Serial EEPROM I2C; MPN: 24AA01-I/P; OC_FARNELL: 1331266; OC_NEWARK: 35M0692
IC8 = 74xx-us:74*374: Octal D type transparent LATCH, edge triggered
IC9 = 74xx-us:74*244: Octal BUFFER and LINE DRIVER, 3-state
IC10 = SparkFun-DigitalIC:ATMEGA328P_PDIP: uC used in the Arduino 32kb flash, 1k EEPROM, 2k SRAM This is the through-hole version of this chip.
IC11-IC21 = 74xx-us:74*373: Octal D type transparent LATCH, edge triggered
IN S0 S1-S7 = switch:M9040P: TOGGLE SWITCH Marquardt
JP1 = SparkFun-Connectors:FTDI_DEVICE: Connector which mates to FTDI basic or FTDI cable.
L0 L1-L7 LED1-LED5 OUT PWR = led:LED: LED OSRAM: - CHIPLED LG R971, LG N971, LY N971, LG Q971, LY Q971, LO R971, LY R971 LH N974, LH R974 LS Q976, LO Q976, LY Q976 LO Q996 - Hyper CHIPLED LW Q18S LB Q993, LB Q99A, LB R99A - SideLED LS A670, LO A670, LY A670, LG A670, LP A670 LB A673, LV A673, LT A673, LW A673 LH A674 LY A675 LS A676, LA A676, LO A676, LY A676, LW A676 LS A679, LY A679, LG A679 - Hyper Micro SIDELED® LS Y876, LA Y876, LO Y876, LY Y876 LT Y87S - SmartLED LW L88C, LW L88S LB L89C, LB L89S, LG L890 LS L89K, LO L89K, LY L89K LS L896, LA L896, LO L896, LY L896 - TOPLED LS T670, LO T670, LY T670, LG T670, LP T670 LSG T670, LSP T670, LSY T670, LOP T670, LYG T670 LG T671, LOG T671, LSG T671 LB T673, LV T673, LT T673, LW T673 LH T674 LS T676, LA T676, LO T676, LY T676, LB T676, LH T676, LSB T676, LW T676 LB T67C, LV T67C, LT T67C, LS T67K, LO T67K, LY T67K, LW E67C LS E67B, LA E67B, LO E67B, LY E67B, LB E67C, LV E67C, LT E67C LW T67C LS T679, LY T679, LG T679 LS T770, LO T770, LY T770, LG T770, LP T770 LB T773, LV T773, LT T773, LW T773 LH T774 LS E675, LA E675, LY E675, LS T675 LS T776, LA T776, LO T776, LY T776, LB T776 LHGB T686 LT T68C, LB T68C - Hyper Mini TOPLED® LB M676 - Mini TOPLED Santana® LG M470 LS M47K, LO M47K, LY M47K Source: http://www.osram.convergy.de LUXEON: - LUMILED® LXK2-PW12-R00, LXK2-PW12-S00, LXK2-PW14-U00, LXK2-PW14-V00 LXK2-PM12-R00, LXK2-PM12-S00, LXK2-PM14-U00 LXK2-PE12-Q00, LXK2-PE12-R00, LXK2-PE12-S00, LXK2-PE14-T00, LXK2-PE14-U00 LXK2-PB12-K00, LXK2-PB12-L00, LXK2-PB12-M00, LXK2-PB14-N00, LXK2-PB14-P00, LXK2-PB14-Q00 LXK2-PR12-L00, LXK2-PR12-M00, LXK2-PR14-Q00, LXK2-PR14-R00 LXK2-PD12-Q00, LXK2-PD12-R00, LXK2-PD12-S00 LXK2-PH12-R00, LXK2-PH12-S00 LXK2-PL12-P00, LXK2-PL12-Q00, LXK2-PL12-R00 Source: www.luxeon.com KINGBRIGHT: KA-3528ASYC Source: www.kingbright.com
Q1 = crystal:CRYSTAL: CRYSTAL; OC_FARNELL: 1667008; OC_NEWARK: unknown
R1 = eagle-ltspice:R: RESISTOR, European symbol; SPICEMODEL: NONE; SPICEPREFIX: R
R2-R7 = adafruit:R-US_: RESISTOR, American symbol
R8-R25 = resistor:R-US_: RESISTOR, American symbol
RN1-RN4 = resistor-net:RNX8: RESISTOR NETWORK; OC_FARNELL: unknown; OC_NEWARK: unknown
S-A S-B = switch:9070-1W: TOGGLE SWITCH Marquardt
SOFT-RESET = SparkFun-Electromechanical:SWITCH-MOMENTARY-2: Various NO switches- pushbuttons, reed, etc
X1 = con-vg:FABC96R: CONNECTOR female, 96 pins, type R, rows ABC, grid 2.54 mm

## Board
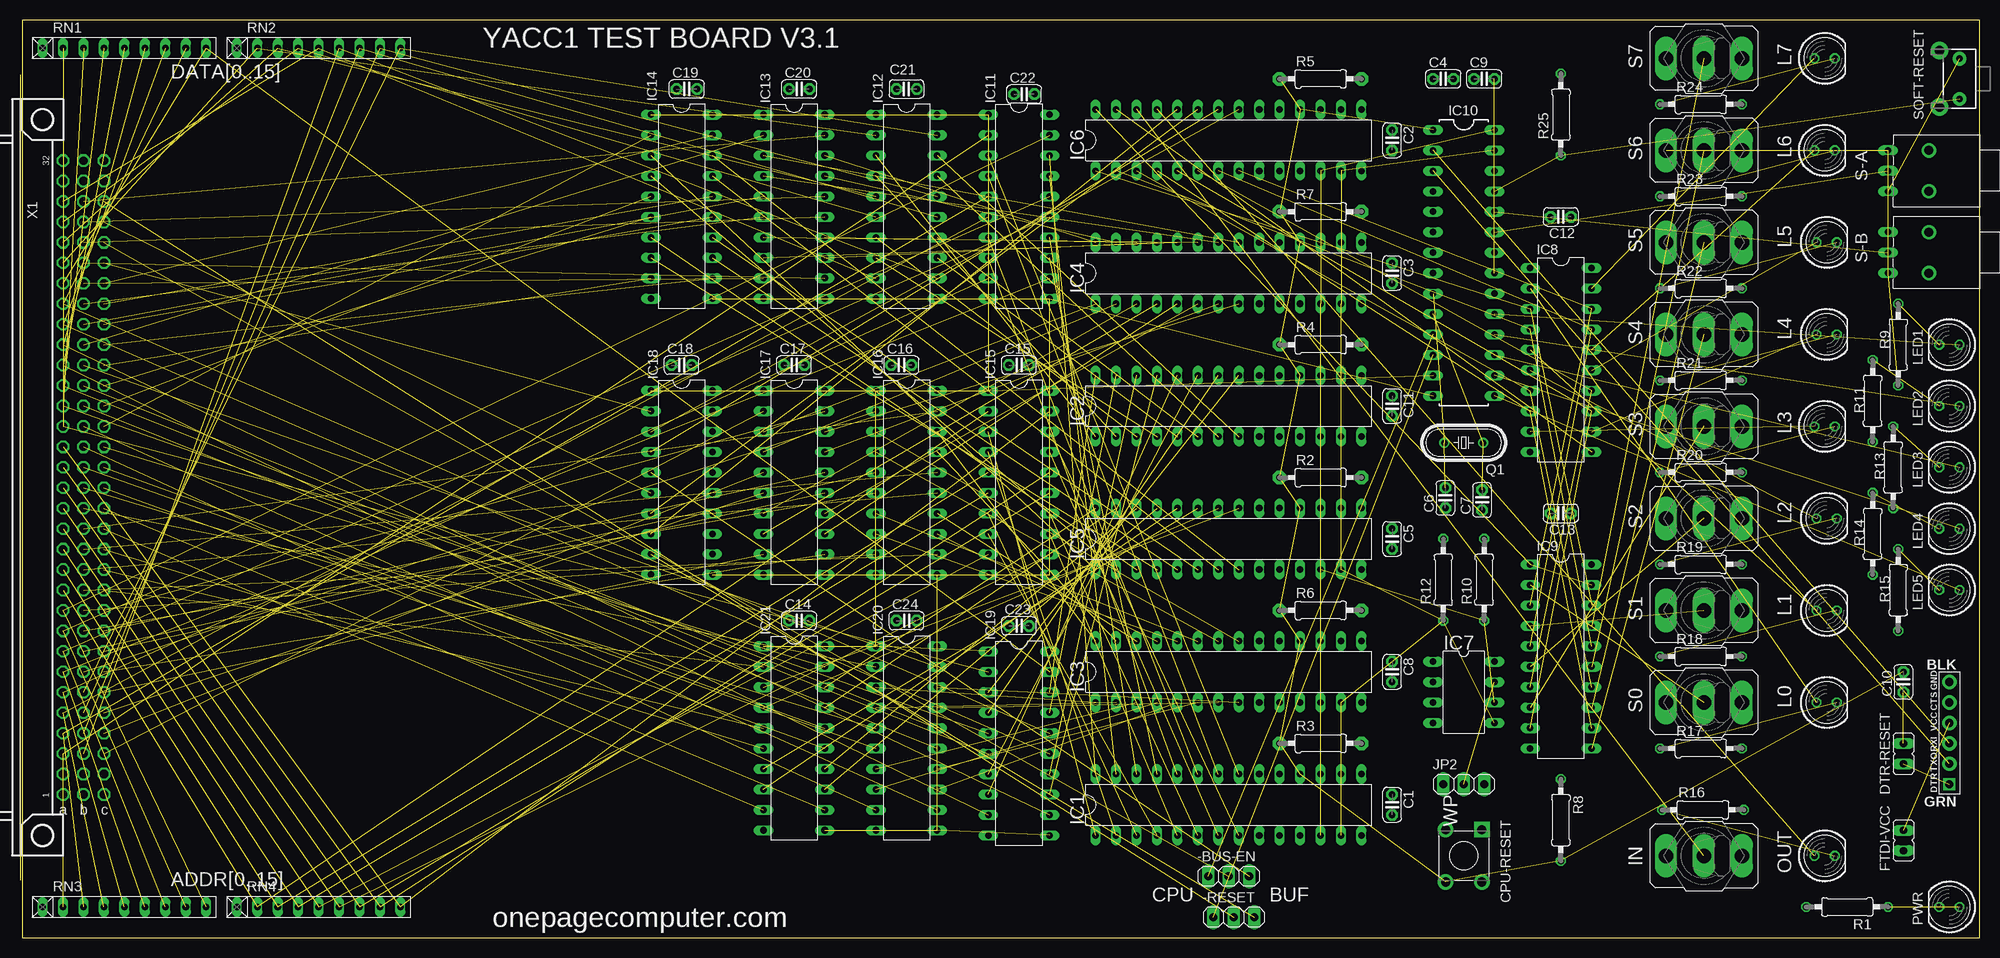
[diagram p5: board, top side]
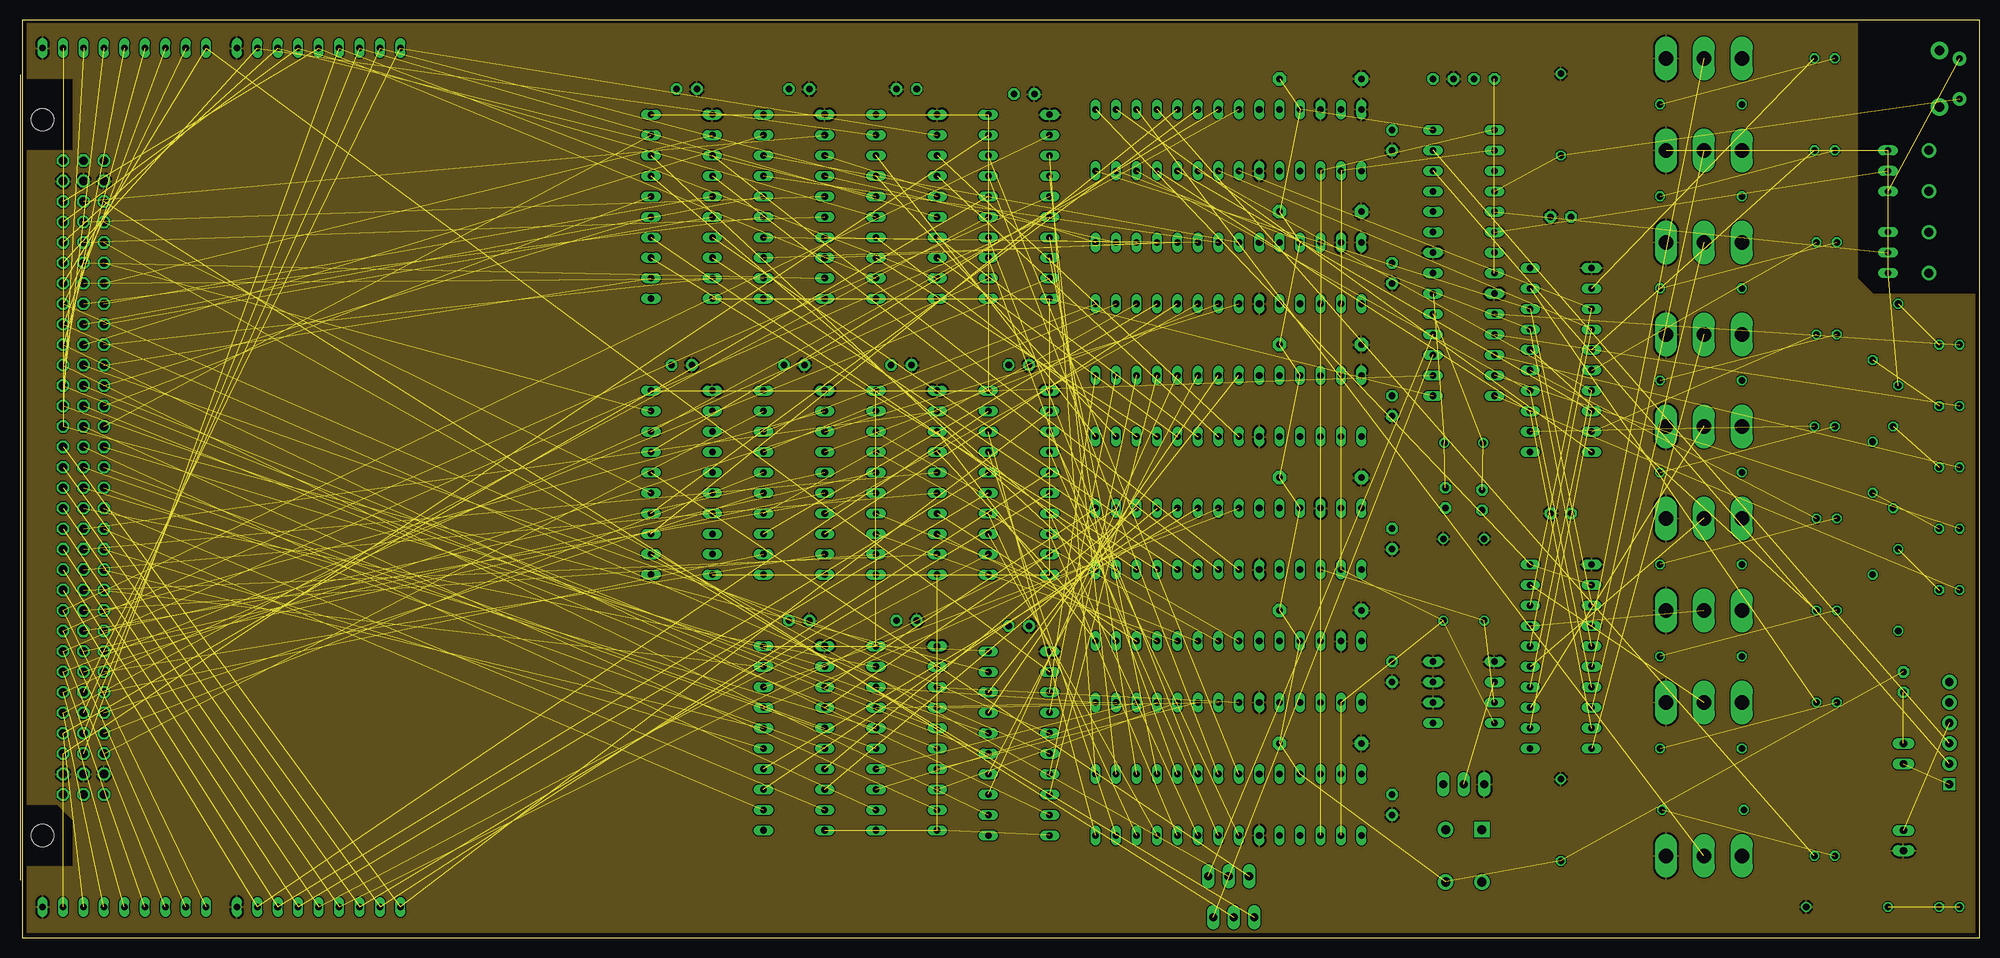
[diagram p6: board, inner layer Route2]
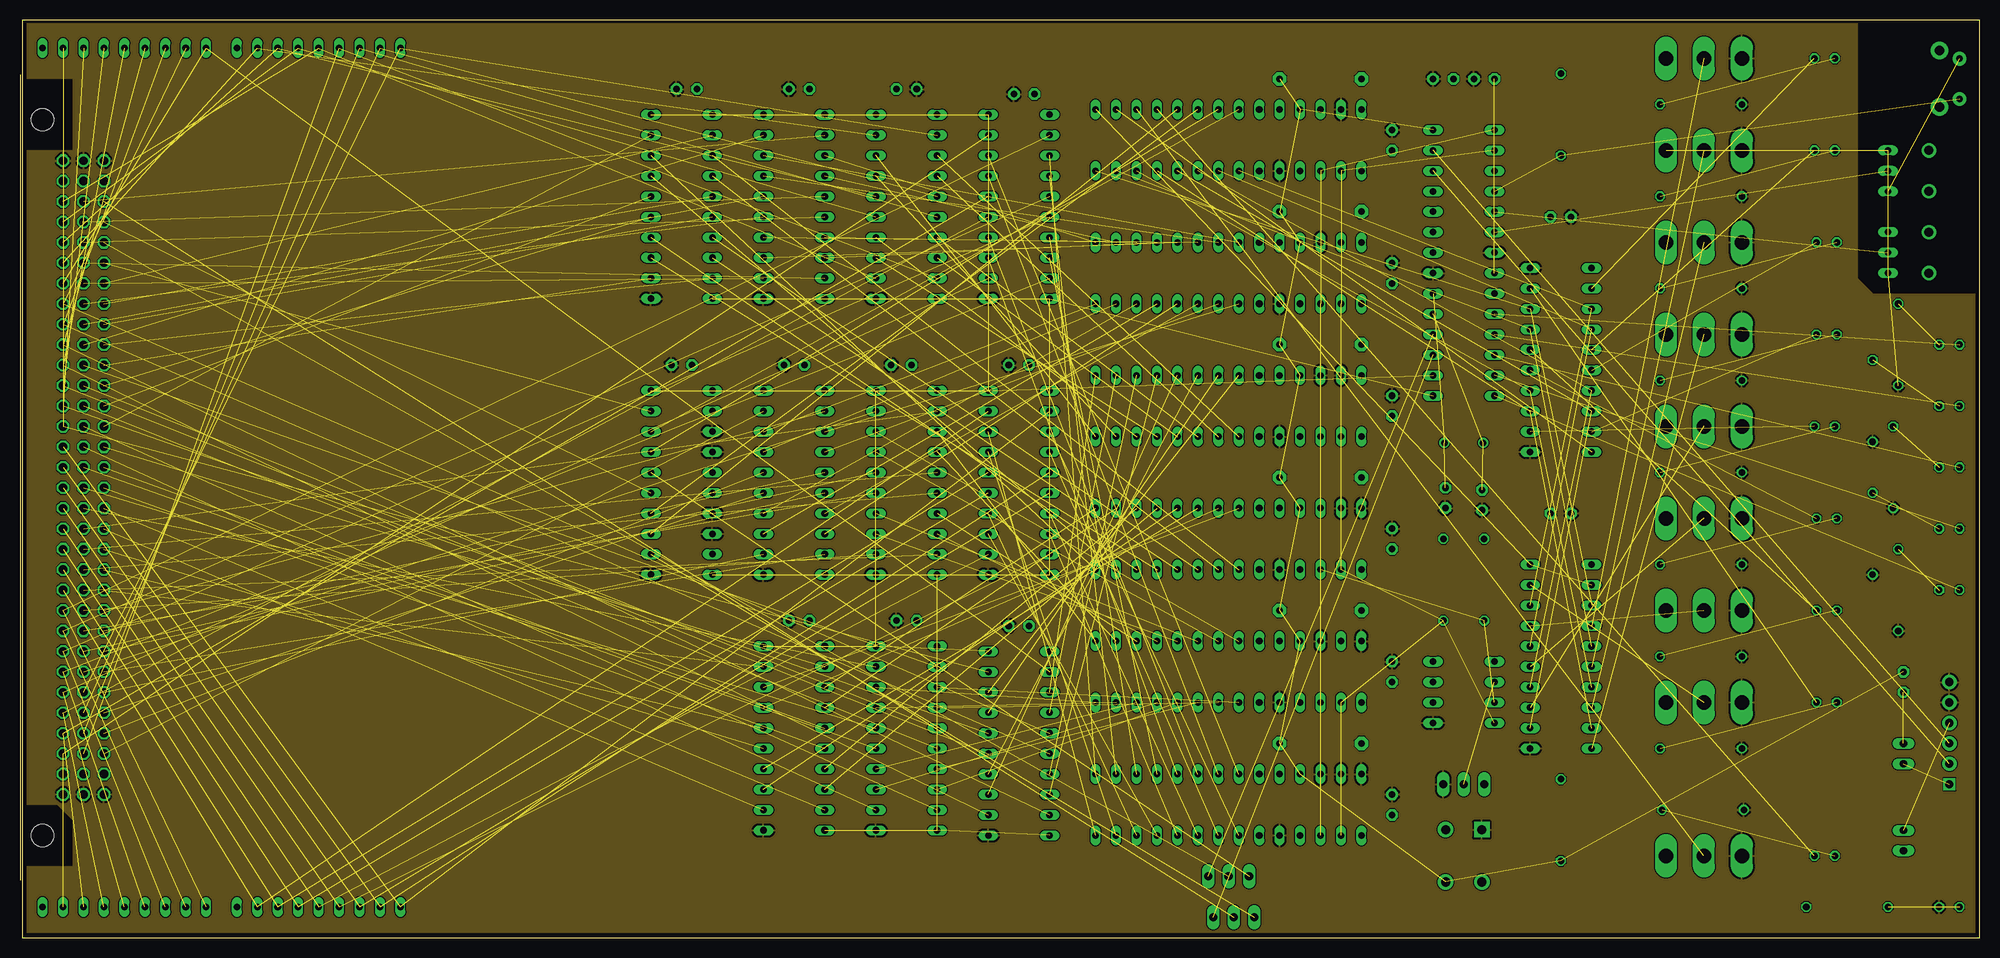
[diagram p7: board, inner layer Route15]

Size 243.19 x 113.97 mm. Coordinates in mm from the lower left corner, seen from the top.
Outline: 0,0 243.19,0 243.19,113.97 0,113.97 0,0
Copper layers (1*2*15*16): Top 0.035559375mm / dielectric 0.17018125mm / Route2 0.01778125mm / dielectric 47mil / Route15 0.01778125mm / dielectric 0.17018125mm / Bottom 0.035559375mm
Design rules "oshpark-4layer": minimum track width 5mil, minimum drill 10mil, track to track 5mil, track to pad 5mil, pad to pad 5mil, via to via 5mil, smd to smd 5mil, copper to edge 15mil, drill to drill 6mil, minimum pad ring 4mil, minimum via ring 4mil, stop-mask expansion 2.5mil, vias tented up to drill 0mil, thermal gap 10mil

### Footprints (pad centres in the part's own frame; a part is rotated, then mirrored left to right if it is on the bottom)
1X03 = drill 1.016 long: 1 -2.54,0; 2 0,0; 3 2.54,0
C025-024X044 = drill 0.813 pad 1.422 octagon: 1 -1.27,0; 2 1.27,0
SW4-6.2X6.2X5.0MM = drill 1.143 pad 1.905 square: 1 -3.25,2.25 | drill 1.143 pad 1.905: 2 -3.25,-2.25; 3 3.25,-2.25; 4 3.25,2.25
JP1 = drill 0.914 long: 1 0,-1.27; 2 0,1.27
DIL28-3 = drill 0.813 long: 1 -16.51,-3.81; 2 -13.97,-3.81; 3 -11.43,-3.81; 4 -8.89,-3.81; 5 -6.35,-3.81; 6 -3.81,-3.81; 7 -1.27,-3.81; 8 1.27,-3.81; 9 3.81,-3.81; 10 6.35,-3.81; 11 8.89,-3.81; 12 11.43,-3.81; 13 13.97,-3.81; 14 16.51,-3.81; 15 16.51,3.81; 16 13.97,3.81; 17 11.43,3.81; 18 8.89,3.81; 19 6.35,3.81; 20 3.81,3.81; 21 1.27,3.81; 22 -1.27,3.81; 23 -3.81,3.81; 24 -6.35,3.81; 25 -8.89,3.81; 26 -11.43,3.81; 27 -13.97,3.81; 28 -16.51,3.81
DIL8 = drill 0.813 long: 1 -3.81,-3.81; 2 -1.27,-3.81; 3 1.27,-3.81; 4 3.81,-3.81; 5 3.81,3.81; 6 1.27,3.81; 7 -1.27,3.81; 8 -3.81,3.81
DIL20 = drill 0.813 long: 1 -11.43,-3.81; 2 -8.89,-3.81; 3 -6.35,-3.81; 4 -3.81,-3.81; 5 -1.27,-3.81; 6 1.27,-3.81; 7 3.81,-3.81; 8 6.35,-3.81; 9 8.89,-3.81; 10 11.43,-3.81; 11 11.43,3.81; 12 8.89,3.81; 13 6.35,3.81; 14 3.81,3.81; 15 1.27,3.81; 16 -1.27,3.81; 17 -3.81,3.81; 18 -6.35,3.81; 19 -8.89,3.81; 20 -11.43,3.81
M9040P = drill 1.803 long: 1 0,4.699; 2 0,0; 3 0,-4.699
FTDI_DEVICE_SIDE = drill 1 square: P$1 -6.35,0 | drill 1.016 pad 1.778: P$2 -3.81,0; P$3 -1.27,0; P$4 1.27,0; P$5 3.81,0; P$6 6.35,0
LED5MM = drill 0.813 octagon: A -1.27,0; K 1.27,0
HC49/S = drill 0.813: 1 -2.413,0; 2 2.413,0
0207/10 = drill 0.813 octagon: 1 -5.08,0; 2 5.08,0
0207/10' = drill 0.813 pad 1.676 octagon: 1 -5.08,0; 2 5.08,0
RN-9 = drill 0.813 long: 1 -10.16,0; 2 -7.62,0; 3 -5.08,0; 4 -2.54,0; 5 0,0; 6 2.54,0; 7 5.08,0; 8 7.62,0; 9 10.16,0
9070-1W = drill 0.813 long: 1 5.08,-2.54; 2 5.08,0; 3 5.08,2.54 | drill 1.118 pad 1.778: B 0,-2.54; B1 0,2.54
TACTILE-PTH-SIDEEZ = drill 0.8 pad 1.7: 1 -2.5,0; 2 2.5,0 | drill 1.2 pad 2.2: ANCHOR1 -3.5,2.5; ANCHOR2 3.5,2.5
FABC96R = drill 1.016 octagon: A1 -2.54,39.37; A2 -2.54,36.83; A3 -2.54,34.29; A4 -2.54,31.75; A5 -2.54,29.21; A6 -2.54,26.67; A7 -2.54,24.13; A8 -2.54,21.59; A9 -2.54,19.05; A10 -2.54,16.51; A11 -2.54,13.97; A12 -2.54,11.43; A13 -2.54,8.89; A14 -2.54,6.35; A15 -2.54,3.81; A16 -2.54,1.27; A17 -2.54,-1.27; A18 -2.54,-3.81; A19 -2.54,-6.35; A20 -2.54,-8.89; A21 -2.54,-11.43; A22 -2.54,-13.97; A23 -2.54,-16.51; A24 -2.54,-19.05; A25 -2.54,-21.59; A26 -2.54,-24.13; A27 -2.54,-26.67; A28 -2.54,-29.21; A29 -2.54,-31.75; A30 -2.54,-34.29; A31 -2.54,-36.83; A32 -2.54,-39.37; B1 -5.08,39.37; B2 -5.08,36.83; B3 -5.08,34.29; B4 -5.08,31.75; B5 -5.08,29.21; B6 -5.08,26.67; B7 -5.08,24.13; B8 -5.08,21.59; B9 -5.08,19.05; B10 -5.08,16.51; B11 -5.08,13.97; B12 -5.08,11.43; B13 -5.08,8.89; B14 -5.08,6.35; B15 -5.08,3.81; B16 -5.08,1.27; B17 -5.08,-1.27; B18 -5.08,-3.81; B19 -5.08,-6.35; B20 -5.08,-8.89; B21 -5.08,-11.43; B22 -5.08,-13.97; B23 -5.08,-16.51; B24 -5.08,-19.05; B25 -5.08,-21.59; B26 -5.08,-24.13; B27 -5.08,-26.67; B28 -5.08,-29.21; B29 -5.08,-31.75; B30 -5.08,-34.29; B31 -5.08,-36.83; B32 -5.08,-39.37; C1 -7.62,39.37; C2 -7.62,36.83; C3 -7.62,34.29; C4 -7.62,31.75; C5 -7.62,29.21; C6 -7.62,26.67; C7 -7.62,24.13; C8 -7.62,21.59; C9 -7.62,19.05; C10 -7.62,16.51; C11 -7.62,13.97; C12 -7.62,11.43; C13 -7.62,8.89; C14 -7.62,6.35; C15 -7.62,3.81; C16 -7.62,1.27; C17 -7.62,-1.27; C18 -7.62,-3.81; C19 -7.62,-6.35; C20 -7.62,-8.89; C21 -7.62,-11.43; C22 -7.62,-13.97; C23 -7.62,-16.51; C24 -7.62,-19.05; C25 -7.62,-21.59; C26 -7.62,-24.13; C27 -7.62,-26.67; C28 -7.62,-29.21; C29 -7.62,-31.75; C30 -7.62,-34.29; C31 -7.62,-36.83; C32 -7.62,-39.37 | hole 2.794: 0,-44.456; 0,44.456

### Placement (x,y rotation side)
-BUS-EN  149.86,7.62 0 top
-RESET  150.5,2.54 0 top
C1  170.18,16.51 270 top
C2  170.18,99.06 270 top
C3  170.18,82.55 270 top
C4  176.53,106.68 0 top
C5  170.18,49.53 270 top
C6  176.78,54.61 90 top
C7  181.36,54.36 90 top
C8  170.18,33.02 270 top
C9  181.61,106.68 0 top
C10  233.68,31.75 90 top
C11  170.18,66.04 270 top
C12  191.13,89.53 180 top
C13  191.13,52.7 180 top
C14  96.52,39.37 0 top
C15  123.83,71.12 0 top
C16  109.22,71.12 0 top
C17  95.89,71.12 0 top
C18  81.92,71.12 0 top
C19  82.55,105.41 0 top
C20  96.52,105.41 0 top
C21  109.86,105.41 180 top
C22  124.46,104.78 0 top
C23  123.83,38.73 0 top
C24  109.86,39.37 0 top
CPU-RESET  179.07,10.16 270 top
DTR-RESET  233.68,22.86 0 top
FTDI-VCC  233.68,12.06 0 top
IC1  149.86,16.51 0 top
IC2  149.86,66.04 0 top
IC3  149.86,33.02 0 top
IC4  149.86,82.55 0 top
IC5  149.86,49.53 0 top
IC6  149.86,99.06 0 top
IC7  179.07,30.48 270 top
IC8  191.13,71.75 270 top
IC9  191.13,34.92 270 top
IC10  179.07,83.82 270 top
IC11  123.83,90.81 270 top
IC12  109.86,90.81 270 top
IC13  95.89,90.81 270 top
IC14  81.92,90.81 270 top
IC15  123.83,56.52 270 top
IC16  109.86,56.52 270 top
IC17  95.89,56.52 270 top
IC18  81.92,56.52 270 top
IC19  123.83,24.13 270 top
IC20  109.86,24.77 270 top
IC21  95.89,24.77 270 top
IN  208.91,10.16 90 top
JP1  239.4,25.4 90 top
JP2  179.07,19.05 0 top
L0  224.16,29.21 0 top
L1  224.16,40.64 0 top
L2  224.16,52.07 0 top
L3  223.9,63.5 0 top
L4  224.16,74.93 0 top
L5  224.16,86.36 0 top
L6  223.9,97.79 0 top
L7  223.9,109.22 0 top
LED1  239.4,73.66 180 top
LED2  239.4,66.04 180 top
LED3  239.4,58.42 180 top
LED4  239.4,50.8 180 top
LED5  239.4,43.18 180 top
OUT  223.9,10.16 0 top
PWR  239.4,3.81 180 top
Q1  179.07,61.47 180 top
R1  226.69,3.81 180 top
R2  10k  [0207/10']  161.29,57.15 0 top
R3  10k  [0207/10']  161.29,24.13 0 top
R4  10k  [0207/10']  161.29,73.66 0 top
R5  10k  [0207/10']  161.29,106.68 0 top
R6  10k  [0207/10']  161.29,40.64 0 top
R7  10k  [0207/10']  161.29,90.17 0 top
R8  191.13,14.61 270 top
R9  233.04,73.66 270 top
R10  181.61,44.45 90 top
R11  229.87,66.67 270 top
R12  176.53,44.45 90 top
R13  232.41,58.42 270 top
R14  229.87,50.16 270 top
R15  233.04,43.18 270 top
R16  208.79,15.88 0 top
R17  208.53,23.5 0 top
R18  208.53,34.92 0 top
R19  208.53,46.35 0 top
R20  208.53,57.78 0 top
R21  208.53,69.22 0 top
R22  208.53,80.64 0 top
R23  208.53,92.08 0 top
R24  208.53,103.5 0 top
R25  191.13,102.23 90 top
RN1  12.7,110.49 0 top
RN2  36.83,110.49 0 top
RN3  12.7,3.81 0 top
RN4  36.83,3.81 0 top
S0  208.91,29.21 90 top
S1  208.91,40.64 90 top
S2  208.91,52.07 90 top
S3  208.91,63.5 90 top
S4  208.91,74.93 90 top
S5  208.91,86.36 90 top
S6  208.91,97.79 90 top
S7  208.91,109.22 90 top
S-A  236.85,95.25 180 top
S-B  236.85,85.09 180 top
SOFT-RESET  240.66,106.68 90 top
X1  2.54,57.15 180 top

### Tracks (layer width: path | path; a pad name or v marks a point on that pad's centre or on a via)
-BUF-EN  (11 unrouted)
-RESET  (15 unrouted)
-SOFT-BUS-EN  (1 unrouted)
-SOFT-RESET  (1 unrouted)
A3  (2 unrouted)
A4  (2 unrouted)
A5  (2 unrouted)
A6  (2 unrouted)
A7  (2 unrouted)
A8  (2 unrouted)
A9  (2 unrouted)
A10  (2 unrouted)
A11  (2 unrouted)
A12  (2 unrouted)
A13  (2 unrouted)
A14  (2 unrouted)
A15  (2 unrouted)
A16  (2 unrouted)
A17  (2 unrouted)
A18  (2 unrouted)
A19  (2 unrouted)
A20  (2 unrouted)
A21  (2 unrouted)
A22  (2 unrouted)
A23  (2 unrouted)
A24  (2 unrouted)
A25  (2 unrouted)
A26  (2 unrouted)
A27  (2 unrouted)
A28  (2 unrouted)
A29  (2 unrouted)
A30  (2 unrouted)
ARD-RXIN  (1 unrouted)
ARD-TXOUT  (1 unrouted)
B3  (2 unrouted)
B4  (2 unrouted)
B5  (2 unrouted)
B6  (2 unrouted)
B7  (1 unrouted)
B8  (1 unrouted)
B9  (1 unrouted)
B10  (1 unrouted)
B11  (1 unrouted)
B12  (1 unrouted)
B13  (1 unrouted)
B14  (1 unrouted)
B15  (1 unrouted)
B16  (1 unrouted)
B17  (1 unrouted)
B18  (1 unrouted)
B19  (1 unrouted)
B20  (1 unrouted)
B21  (1 unrouted)
B22  (1 unrouted)
B23  (1 unrouted)
B24  (1 unrouted)
B25  (1 unrouted)
B26  (1 unrouted)
B27  (1 unrouted)
B28  (1 unrouted)
B29  (1 unrouted)
B30  (1 unrouted)
BIT0  (2 unrouted)
BIT1  (2 unrouted)
BIT2  (2 unrouted)
BIT3  (2 unrouted)
BIT4  (2 unrouted)
BIT5  (2 unrouted)
BIT6  (2 unrouted)
BIT7  (2 unrouted)
BUF-A3  (1 unrouted)
BUF-A4  (1 unrouted)
BUF-A5  (1 unrouted)
BUF-A6  (1 unrouted)
BUF-A7  (1 unrouted)
BUF-A8  (1 unrouted)
BUF-A9  (1 unrouted)
BUF-A10  (1 unrouted)
BUF-A11  (1 unrouted)
BUF-A12  (1 unrouted)
BUF-A13  (1 unrouted)
BUF-A14  (1 unrouted)
BUF-A15  (1 unrouted)
BUF-A16  (1 unrouted)
BUF-A17  (1 unrouted)
BUF-A18  (1 unrouted)
BUF-A19  (1 unrouted)
BUF-A20  (1 unrouted)
BUF-A21  (1 unrouted)
BUF-A22  (1 unrouted)
BUF-A23  (1 unrouted)
BUF-A24  (1 unrouted)
BUF-A25  (1 unrouted)
BUF-A26  (1 unrouted)
BUF-A27  (1 unrouted)
BUF-A28  (1 unrouted)
BUF-A29  (1 unrouted)
BUF-A30  (1 unrouted)
BUF-B3  (1 unrouted)
BUF-B4  (1 unrouted)
BUF-B5  (1 unrouted)
BUF-B6  (1 unrouted)
BUF-B7  (1 unrouted)
BUF-B8  (1 unrouted)
BUF-B9  (1 unrouted)
BUF-B10  (1 unrouted)
BUF-B11  (1 unrouted)
BUF-B12  (1 unrouted)
BUF-B13  (1 unrouted)
BUF-B14  (1 unrouted)
BUF-B15  (1 unrouted)
BUF-B16  (1 unrouted)
BUF-B17  (1 unrouted)
BUF-B18  (1 unrouted)
BUF-B19  (1 unrouted)
BUF-B20  (1 unrouted)
BUF-B21  (1 unrouted)
BUF-B22  (1 unrouted)
BUF-B23  (1 unrouted)
BUF-B24  (1 unrouted)
BUF-B25  (1 unrouted)
BUF-B26  (1 unrouted)
BUF-B27  (1 unrouted)
BUF-B28  (1 unrouted)
BUF-B29  (1 unrouted)
BUF-B30  (1 unrouted)
BUF-C3  (1 unrouted)
BUF-C4  (1 unrouted)
BUF-C5  (1 unrouted)
BUF-C6  (1 unrouted)
BUF-C7  (1 unrouted)
BUF-C8  (1 unrouted)
BUF-C9  (1 unrouted)
BUF-C10  (1 unrouted)
BUF-C11  (1 unrouted)
BUF-C12  (1 unrouted)
BUF-C13  (1 unrouted)
BUF-C14  (1 unrouted)
BUF-C15  (1 unrouted)
BUF-C16  (1 unrouted)
BUF-C17  (1 unrouted)
BUF-C18  (1 unrouted)
BUF-C19  (1 unrouted)
BUF-C20  (1 unrouted)
BUF-C21  (1 unrouted)
BUF-C22  (1 unrouted)
BUF-C23  (1 unrouted)
BUF-C24  (1 unrouted)
BUF-C25  (1 unrouted)
BUF-C26  (1 unrouted)
BUF-C27  (1 unrouted)
BUF-C28  (1 unrouted)
BUF-C29  (1 unrouted)
BUF-C30  (1 unrouted)
BUF-CLK  (11 unrouted)
C3  (1 unrouted)
C4  (1 unrouted)
C5  (1 unrouted)
C6  (1 unrouted)
C7  (1 unrouted)
C8  (1 unrouted)
C9  (1 unrouted)
C10  (1 unrouted)
C11  (1 unrouted)
C12  (1 unrouted)
C13  (1 unrouted)
C14  (1 unrouted)
C15  (1 unrouted)
C16  (1 unrouted)
C17  (1 unrouted)
C18  (1 unrouted)
C19  (1 unrouted)
C20  (1 unrouted)
C21  (1 unrouted)
C22  (1 unrouted)
C23  (1 unrouted)
C24  (1 unrouted)
C25  (1 unrouted)
C26  (1 unrouted)
C27  (1 unrouted)
C28  (1 unrouted)
C29  (1 unrouted)
C30  (1 unrouted)
GND  (3 unrouted)
  pour Route15: 0.64,113.67 227.97,113.67 227.97,81.92 229.87,80.01 242.57,80.01 242.57,0.64 0.64,0.64 0.64,8.89 6.35,8.89 6.35,14.61 4.45,16.51 0.64,16.51 0.64,97.79 6.35,97.79 6.35,106.68 0.64,106.68
IN-SWITCH  (1 unrouted)
LEDS-LD  (1 unrouted)
N$1  (1 unrouted)
N$2  (1 unrouted)
N$3  (2 unrouted)
N$4  (2 unrouted)
N$5  (1 unrouted)
N$6  (1 unrouted)
N$7  (1 unrouted)
N$8  (1 unrouted)
N$9  (1 unrouted)
N$10  (1 unrouted)
N$11  (1 unrouted)
N$12  (1 unrouted)
N$13  (1 unrouted)
N$14  (1 unrouted)
N$15  (1 unrouted)
N$16  (1 unrouted)
N$17  (1 unrouted)
N$18  (1 unrouted)
N$19  (1 unrouted)
N$20  (1 unrouted)
N$21  (1 unrouted)
N$22  (1 unrouted)
N$23  (1 unrouted)
N$24  (1 unrouted)
N$25  (1 unrouted)
N$26  (1 unrouted)
N$27  (1 unrouted)
N$28  (1 unrouted)
N$29  (1 unrouted)
N$30  (1 unrouted)
N$31  (1 unrouted)
N$32  (1 unrouted)
N$33  (1 unrouted)
N$34  (1 unrouted)
N$35  (1 unrouted)
N$36  (1 unrouted)
N$37  (1 unrouted)
N$38  (1 unrouted)
N$39  (2 unrouted)
N$40  (1 unrouted)
N$41  (1 unrouted)
N$42  (1 unrouted)
N$43  (1 unrouted)
N$44  (1 unrouted)
N$45  (1 unrouted)
N$46  (1 unrouted)
N$47  (1 unrouted)
N$48  (1 unrouted)
OUT-LED  (1 unrouted)
SCL  (8 unrouted)
SDA  (8 unrouted)
SWITCHES-RD  (2 unrouted)
VCC  (2 unrouted)
  pour Route2: 0.64,113.67 227.97,113.67 227.97,81.92 229.87,80.01 242.57,80.01 242.57,0.64 0.64,0.64 0.64,8.89 6.35,8.89 6.35,14.61 4.45,16.51 0.64,16.51 0.64,97.79 6.35,97.79 6.35,106.68 0.64,106.68

### Text on the board
tNames: YACC1 TEST BOARD V3.1 | DATA[0..15] | WP | ADDR[0..15] | CPU | BUF | onepagecomputer.com